# EAGLE design RPi_RFM12B_ISP (EAGLE 6.2)
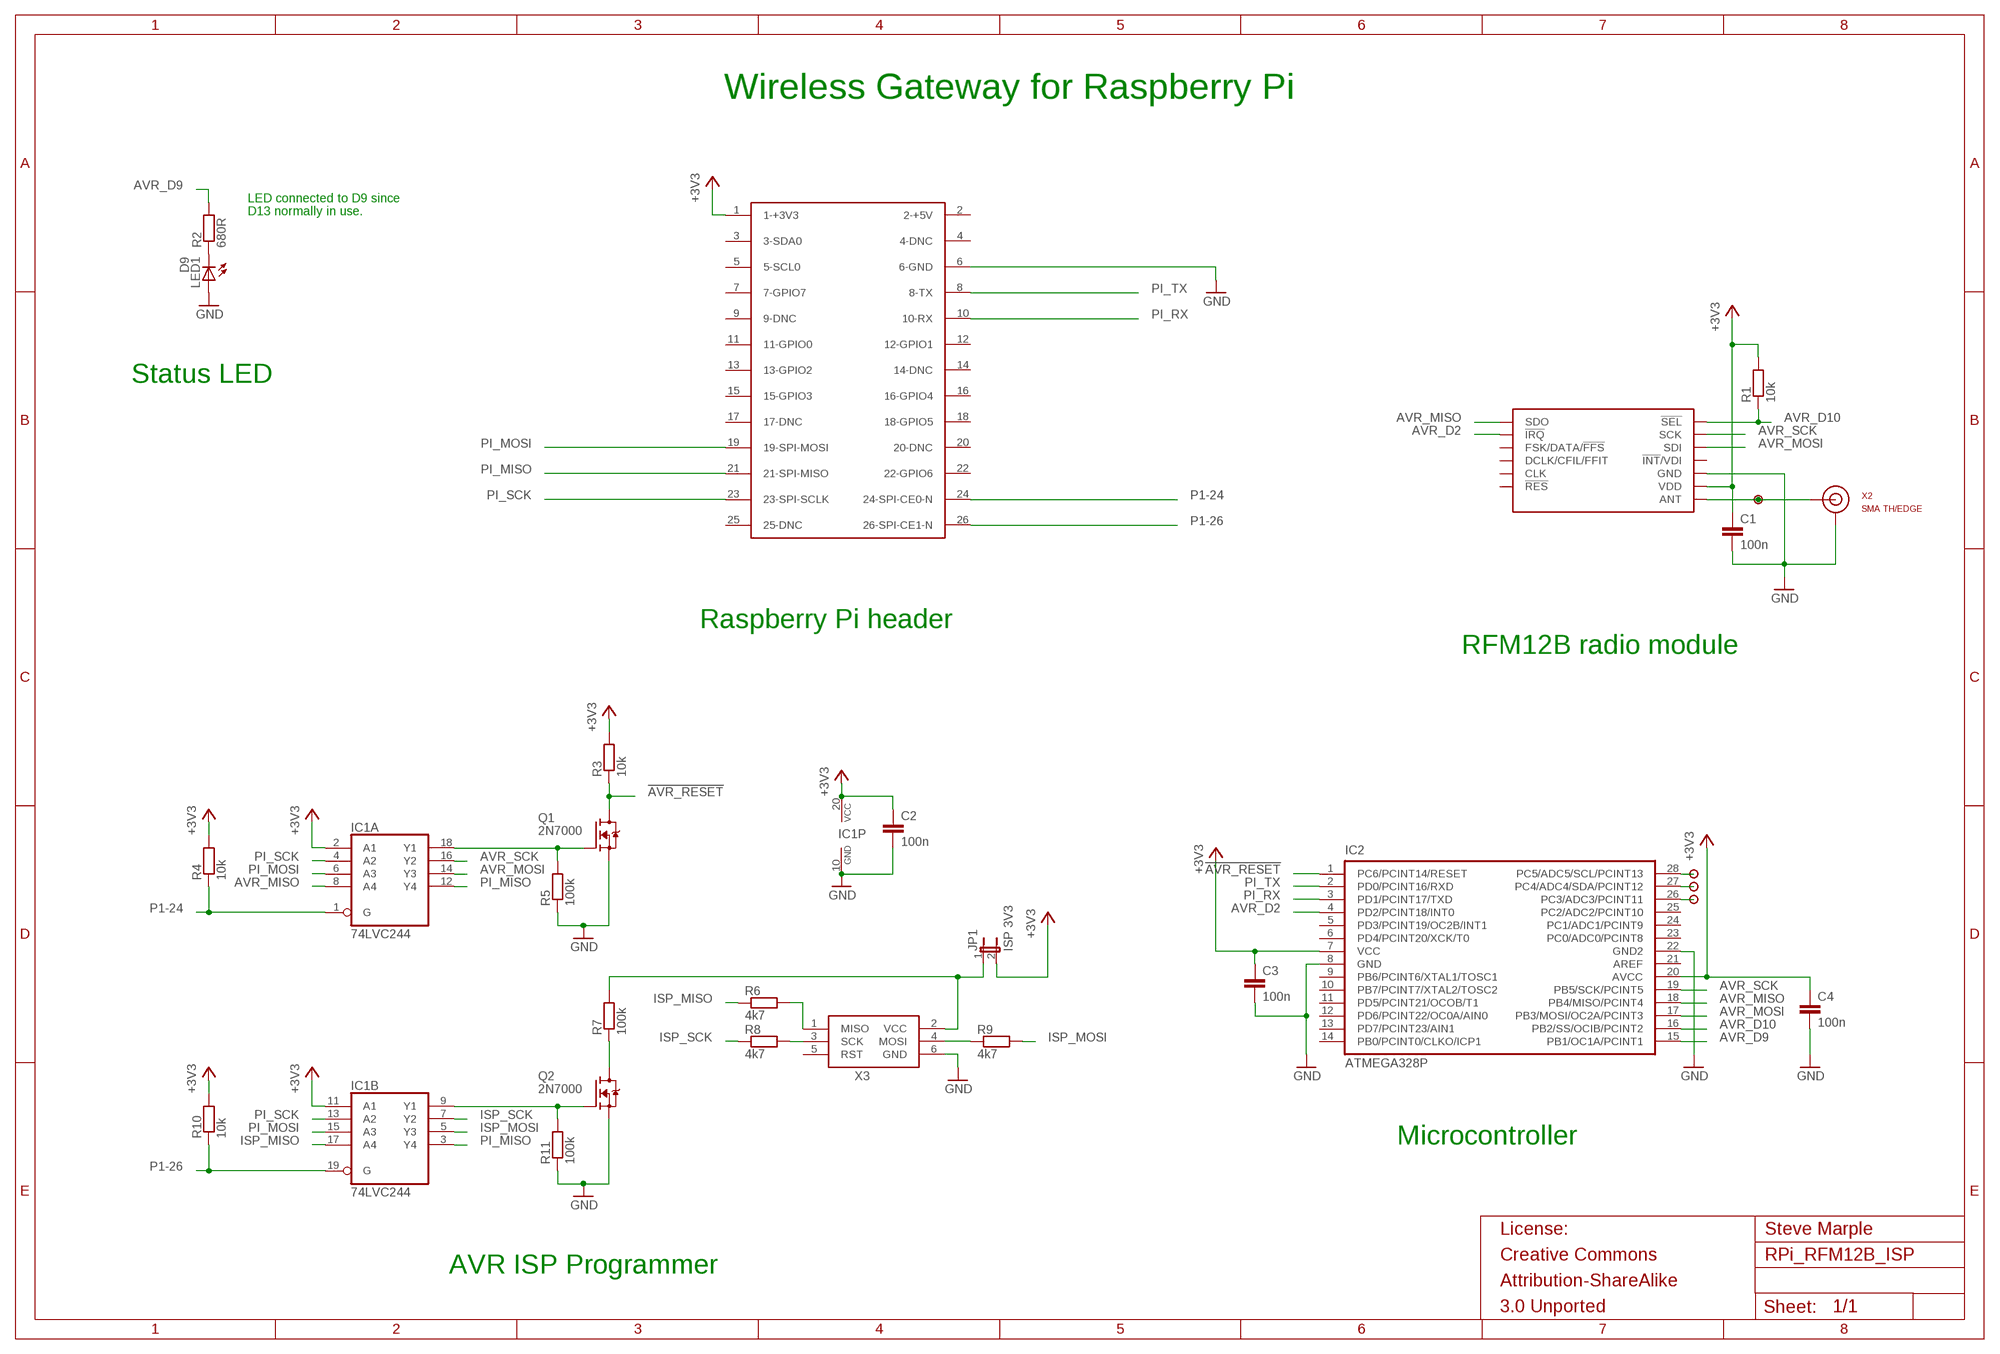
[diagram p0: schematic, sheet 1]

## Parts
AVR_A1  PAD  [PAD]
AVR_A2  PAD  [PAD]
AVR_A3  PAD  [PAD]
C1  100n  CAPPTH  [CAP-PTH-SMALL]
C2  100n  CAPPTH  [CAP-PTH-SMALL]
C3  100n  CAPPTH  [CAP-PTH-SMALL]
C4  100n  CAPPTH  [CAP-PTH-SMALL]
IC1  74LVC244  74HC244N  [DIL20]
IC2  ATMEGA328P  IC_UC_ATMEGA328PDIL  [DIL28-N]
JP1  ISP 3V3  JUMPER-2PTH  [1X02]
LED1  D9  LED3MM  [LED3MM]
Q1  2N7000  [TO-92]
Q2  2N7000  [TO-92]
R1  10k  RESISTOR  [RES-AXIAL-0.4]
R2  680R  RESISTOR  [RES-AXIAL-0.4]
R3  10k  RESISTOR  [RES-AXIAL-0.4]
R4  10k  RESISTOR  [RES-AXIAL-0.4]
R5  100k  RESISTOR  [RES-AXIAL-0.4]
R6  4k7  RESISTOR  [RES-AXIAL-0.4]
R7  100k  RESISTOR  [RES-AXIAL-0.4]
R8  4k7  RESISTOR  [RES-AXIAL-0.4]
R9  4k7  RESISTOR  [RES-AXIAL-0.4]
R10  10k  RESISTOR  [RES-AXIAL-0.4]
R11  100k  RESISTOR  [RES-AXIAL-0.4]
RF1  RFM12B  RFM12BSMD  [RFM12B]
RFM12B_ANT  PAD  [PAD]
X1  P1A  RASPBERRY-PIHEADER  [RASPBERRY-PI-HEADER]
X2  SMA TH/EDGE  CONN-SMATHD-SMD-EDGE  [SMA-THD-EDGE]
X3  AVR ISP  AVRISP-HEADER-6-SHROUDED  [CONN-HARTING-ML6]

## Nets
!AVR_RESET: IC2.1(PC6/PCINT14/RESET) Q1.3(D) R3.P$1
+3V3 [power]: C1.1 C2.1 C3.1 C4.1 IC1.2(A:A1) IC1.11(B:A1) IC1.20(P:VCC) IC2.7(VCC) IC2.20(AVCC) JP1.2 R1.P$2 R3.P$2 R4.P$2 R10.P$2 RF1.VDD X1.1(1-+3V3)
AVR_D2: IC2.4(PD2/PCINT18/INT0) RF1.!IRQ
AVR_D9: IC2.15(PB1/OC1A/PCINT1) R2.P$2
AVR_D10: IC2.16(PB2/SS/OCIB/PCINT2) R1.P$1 RF1.!SEL
AVR_MISO: IC1.8(A:A4) IC2.18(PB4/MISO/PCINT4) RF1.SDO
AVR_MOSI: IC1.14(A:Y3) IC2.17(PB3/MOSI/OC2A/PCINT3) RF1.SDI
AVR_SCK: IC1.16(A:Y2) IC2.19(PB5/SCK/PCINT5) RF1.SCK
GND [power]: C1.2 C2.2 C3.2 C4.2 IC1.10(P:GND) IC2.8(GND) IC2.22(GND2) LED1.A Q1.1(S) Q2.1(S) R5.P$1 R11.P$1 RF1.GND@0(GND) RF1.GND@1(GND) X1.6(6-GND) X2.GND@0(GND) X2.GND@1(GND) X2.GND@2(GND) X2.GND@3(GND) X2.GND@EDGE0(GND) X2.GND@EDGE1(GND) X2.GND@EDGE2(GND) X2.GND@EDGE3(GND) X3.6(GND)
ISP_MISO [power]: IC1.17(B:A4) R6.P$1
ISP_MOSI: IC1.5(B:Y3) R9.P$2
ISP_SCK: IC1.7(B:Y2) R8.P$1
N$1 [antenna]: RF1.ANT RFM12B_ANT.1 X2.SIG(SIGNAL) X2.SIG@EDGE(SIGNAL)
N$2: LED1.K(C) R2.P$1
N$3: AVR_A1.1 IC2.28(PC5/ADC5/SCL/PCINT13)
N$4: AVR_A2.1 IC2.27(PC4/ADC4/SDA/PCINT12)
N$5: AVR_A3.1 IC2.26(PC3/ADC3/PCINT11)
N$32: IC1.18(A:Y1) Q1.2(G) R5.P$2
N$44: R8.P$2 X3.3(SCK)
N$45: R6.P$2 X3.1(MISO)
N$47: IC1.9(B:Y1) Q2.2(G) R11.P$2
N$48: Q2.3(D) R7.P$1
N$49: JP1.1 R7.P$2 X3.2(VCC)
N$50: R9.P$1 X3.4(MOSI)
P1-24: IC1.1(A:G) R4.P$1 X1.24(24-SPI-CE0-N)
P1-26: IC1.19(B:G) R10.P$1 X1.26(26-SPI-CE1-N)
PI_MISO: IC1.3(B:Y4) IC1.12(A:Y4) X1.21(21-SPI-MISO)
PI_MOSI: IC1.6(A:A3) IC1.15(B:A3) X1.19(19-SPI-MOSI)
PI_RX: IC2.3(PD1/PCINT17/TXD) X1.10(10-RX)
PI_SCK: IC1.4(A:A2) IC1.13(B:A2) X1.23(23-SPI-SCLK)
PI_TX: IC2.2(PD0/PCINT16/RXD) X1.8(8-TX)
Unconnected: IC2.5(PD3/PCINT19/OC2B/INT1) IC2.6(PD4/PCINT20/XCK/T0) IC2.9(PB6/PCINT6/XTAL1/TOSC1) IC2.10(PB7/PCINT7/XTAL2/TOSC2) IC2.11(PD5/PCINT21/OCOB/T1) IC2.12(PD6/PCINT22/OC0A/AIN0) IC2.13(PD7/PCINT23/AIN1) IC2.14(PB0/PCINT0/CLKO/ICP1) IC2.21(AREF) IC2.23(PC0/ADC0/PCINT8) IC2.24(PC1/ADC1/PCINT9) IC2.25(PC2/ADC2/PCINT10) RF1.!INT!/VDI RF1.!RES RF1.CLK RF1.DCLK/CFIL/FFIT RF1.FSK/DATA/!FFS X1.2(2-+5V) X1.3(3-SDA0) X1.4(4-DNC) X1.5(5-SCL0) X1.7(7-GPIO7) X1.9(9-DNC) X1.11(11-GPIO0) X1.12(12-GPIO1) X1.13(13-GPIO2) X1.14(14-DNC) X1.15(15-GPIO3) X1.16(16-GPIO4) X1.17(17-DNC) X1.18(18-GPIO5) X1.20(20-DNC) X1.22(22-GPIO6) X1.25(25-DNC) X3.5(RST)

## Notes on the sheet
- Wireless Gateway for Raspberry Pi
- LED connected to D9 since
- D13 normally in use.
- Status LED
- Raspberry Pi header
- RFM12B radio module
- Microcontroller
- License: | Steve Marple
- Creative Commons
- AVR ISP Programmer
- Attribution-ShareAlike
- 3.0 Unported

## Library data of the parts
AVR_A1-AVR_A3 RFM12B_ANT = SteveMarple:PAD
C1-C4 = SparkFun:CAP: Capacitor Standard 0603 ceramic capacitor, and 0.1" leaded capacitor.
IC1 = 74xx-eu:74*244: Octal BUFFER and LINE DRIVER, 3-state
IC2 = dp_devices:IC_UC_ATMEGA328P
JP1 = SparkFun:JUMPER-2: Jumper Basic 0.1" spaced jumper. Use with breakaway headers.
LED1 = SparkFun:LED: LEDs Standard schematic elements and footprints for 5mm, 3mm, 1206, and 0603 sized LEDs. 5mm - Spark Fun Electronics SKU : COM-00529 (and others)
Q1 Q2 = SteveMarple:2N7000: 2N7000 FET
R1-R11 = SteveMarple:RESISTOR: 1/4W PTH resistor
RF1 = SteveMarple:RFM12B: RFM12B radio module by HopeRF
X1 = SteveMarple:RASPBERRY-PI: Raspberry Pi Board <http://www.raspberrypi.org/> Jacques Lagnel V1.0 (beta) 2012 Board dimension: Forum 3D model <http://www.raspberrypi.org/forum/general-discussion/mechanical-profile-3d-models?value=3d%20model&type=1&include=1&search=1&ret=all> The GPIO Connector (P1): http://elinux.org/RPi_Low-level_peripherals
X2 = SteveMarple:CONN-SMA: SMA connector
X3 = SteveMarple:AVRISP: AVR ISP HEADER Standard 6 pin header for AVR programming

## Net classes
1 power: width 0.381 mm
2 5V: width 0.381 mm
3 antenna: width 0.61 mm

## Board
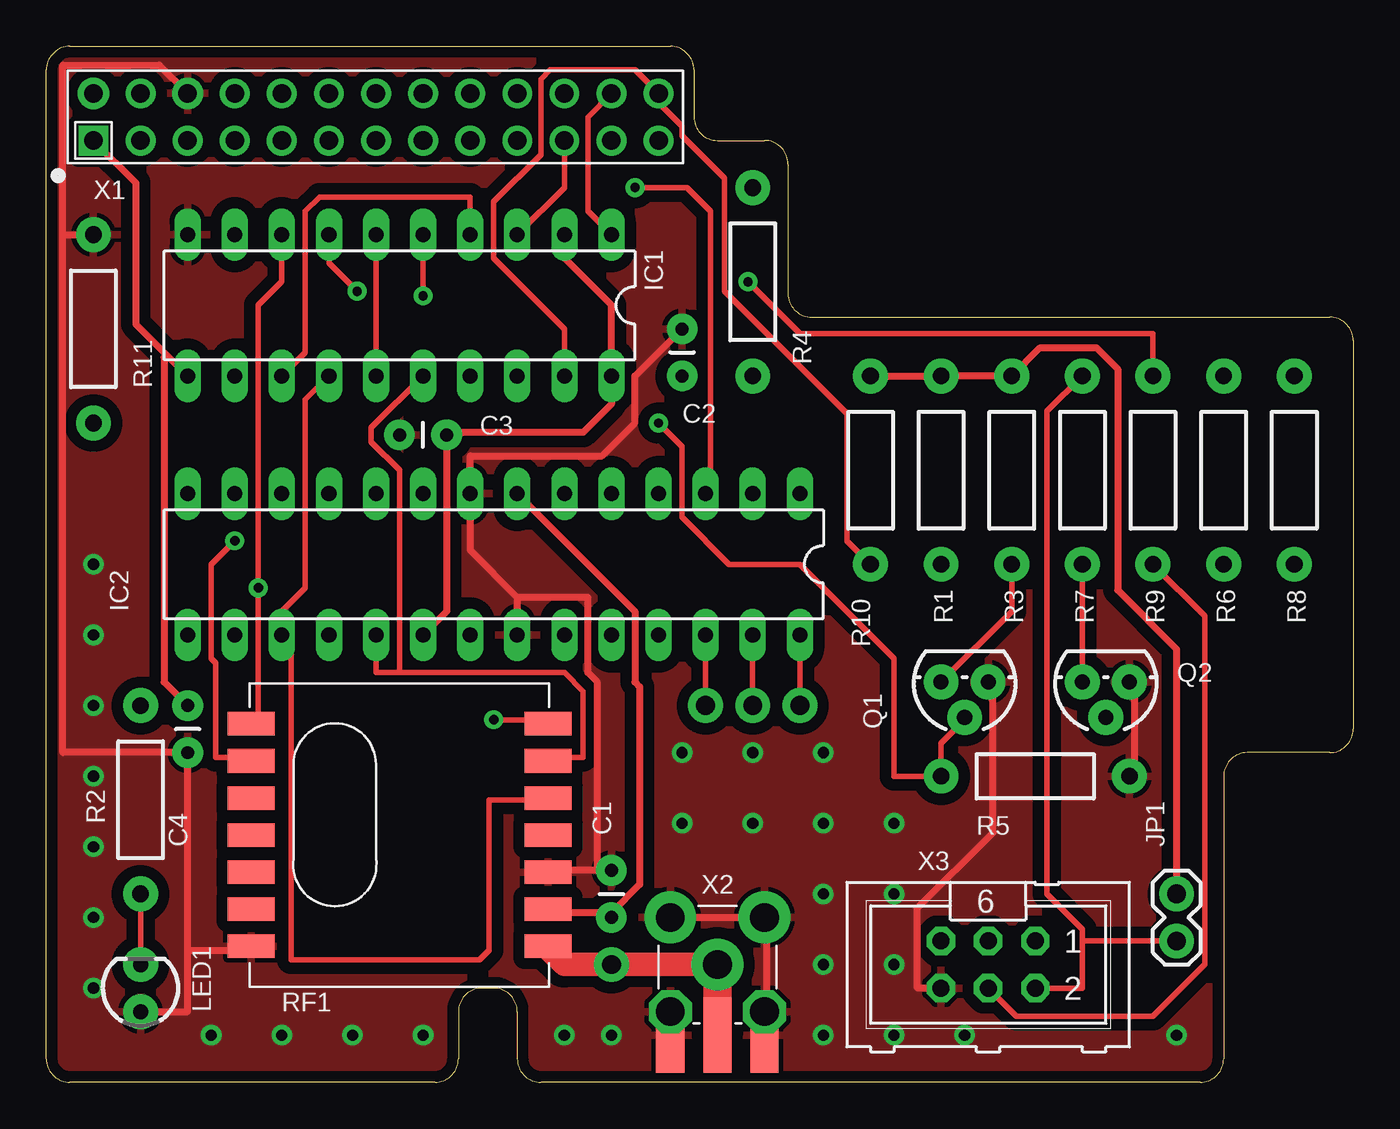
[diagram p1: board, top side]
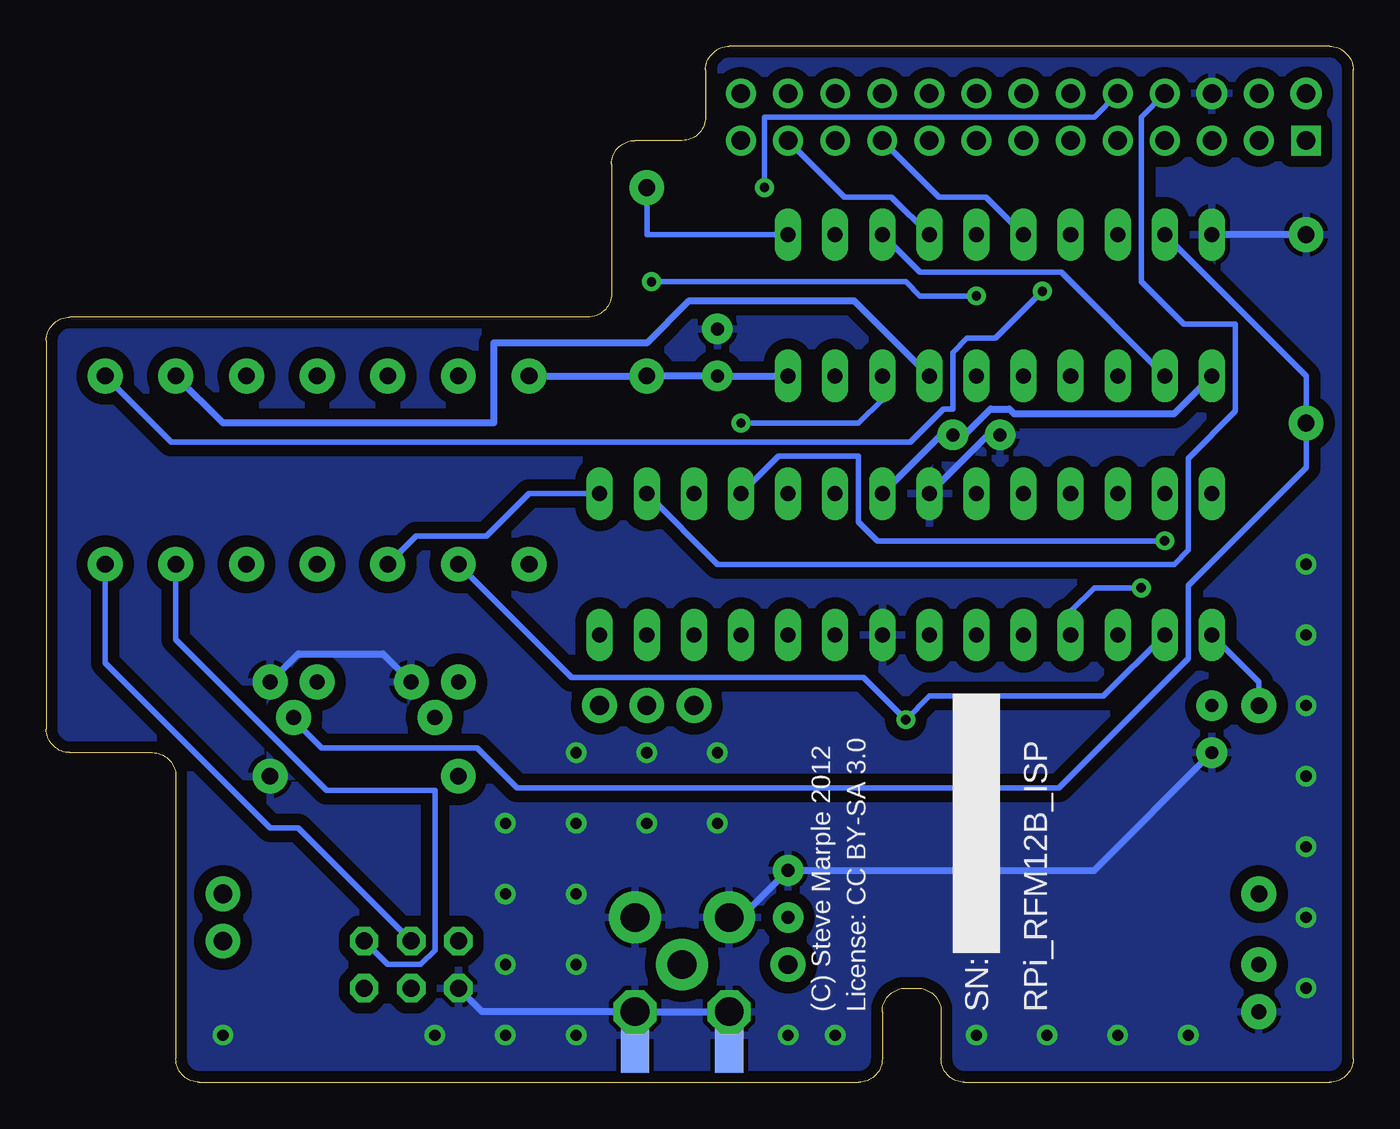
[diagram p2: board, bottom side, seen from below]

Size 70.48 x 55.88 mm. Coordinates in mm from the lower left corner, seen from the top.
Outline: 0,1.27 0,54.61 arc-90 1.27,55.88 33.66,55.88 arc-90 34.92,54.61 34.92,52.07 arc90 36.2,50.8 38.73,50.8 arc-90 40.01,49.53 40.01,42.55 arc90 41.27,41.27 69.22,41.27 arc-90 70.48,40.01 70.48,19.05 arc-90 69.22,17.78 64.77,17.78 arc90 63.5,16.51 63.5,1.27 arc-90 62.23,0 26.67,0 arc-90 25.4,1.27 25.4,3.81 arc90 24.13,5.08 23.5,5.08 arc90 22.23,3.81 22.23,1.27 arc-90 20.95,0 1.27,0 arc-90 0,1.27
Copper layers (1*16): Top 0.035mm / dielectric 1.5mm / Bottom 0.035mm
Design rules: minimum track width 10mil, minimum drill 20mil, track to track 10mil, track to pad 10mil, pad to pad 10mil, via to via 10mil, smd to smd 10mil, copper to edge 0.5mm, drill to drill 8mil, minimum pad ring 12mil, minimum via ring 10mil, stop-mask expansion 4mil, vias tented up to drill 25mil, thermal gap 10mil
tRestrict: area 14.6,7 to 23.5,19.7

### Footprints (pad centres in the part's own frame; a part is rotated, then mirrored left to right if it is on the bottom)
PAD = drill 1.016 pad 1.88: 1 0,0
CAP-PTH-SMALL = drill 0.7 pad 1.651: 1 0,0; 2 2.54,0
DIL20 = drill 0.813 long: 1 -11.43,-3.81; 2 -8.89,-3.81; 3 -6.35,-3.81; 4 -3.81,-3.81; 5 -1.27,-3.81; 6 1.27,-3.81; 7 3.81,-3.81; 8 6.35,-3.81; 9 8.89,-3.81; 10 11.43,-3.81; 11 11.43,3.81; 12 8.89,3.81; 13 6.35,3.81; 14 3.81,3.81; 15 1.27,3.81; 16 -1.27,3.81; 17 -3.81,3.81; 18 -6.35,3.81; 19 -8.89,3.81; 20 -11.43,3.81
DIL28-N = drill 0.813 long: 1 -16.51,-3.81; 2 -13.97,-3.81; 3 -11.43,-3.81; 4 -8.89,-3.81; 5 -6.35,-3.81; 6 -3.81,-3.81; 7 -1.27,-3.81; 8 1.27,-3.81; 9 3.81,-3.81; 10 6.35,-3.81; 11 8.89,-3.81; 12 11.43,-3.81; 13 13.97,-3.81; 14 16.51,-3.81; 15 16.51,3.81; 16 13.97,3.81; 17 11.43,3.81; 18 8.89,3.81; 19 6.35,3.81; 20 3.81,3.81; 21 1.27,3.81; 22 -1.27,3.81; 23 -3.81,3.81; 24 -6.35,3.81; 25 -8.89,3.81; 26 -11.43,3.81; 27 -13.97,3.81; 28 -16.51,3.81
1X02 = drill 1.016 pad 1.88: 1 0,0; 2 2.54,0
LED3MM = drill 0.813 pad 1.88: A -1.27,0; K 1.27,0
TO-92 = drill 0.813 pad 1.88: 1 -1.27,0; 2 0,1.905; 3 1.27,0
RES-AXIAL-0.4 = drill 0.9 pad 1.88: P$1 -5.08,0; P$2 5.08,0
RFM12B = smd 2.54 x 1.27: !INT!/VDI 8,0; !IRQ -8,4; !RES -8,-4; !SEL 8,6; ANT 8,-6; CLK -8,-2; DCLK/CFIL/FFIT -8,0; FSK/DATA/!FFS -8,2; GND@0 -8,-6; GND@1 8,-2; SCK 8,4; SDI 8,2; SDO -8,6; VDD 8,-4
RASPBERRY-PI-HEADER = drill 1 square: 1 0,0 | drill 1 pad 1.676: 2 0,2.54; 6 5.08,2.54 | drill 1: 3 2.54,0; 4 2.54,2.54; 5 5.08,0; 7 7.62,0; 8 7.62,2.54; 9 10.16,0; 10 10.16,2.54; 11 12.7,0; 12 12.7,2.54; 13 15.24,0; 14 15.24,2.54; 15 17.78,0; 16 17.78,2.54; 17 20.32,0; 18 20.32,2.54; 19 22.86,0; 20 22.86,2.54; 21 25.4,0; 22 25.4,2.54; 23 27.94,0; 24 27.94,2.54; 25 30.48,0; 26 30.48,2.54
SMA-THD-EDGE = drill 1.549 pad 2.794: GND@0 -2.54,2.54; GND@1 2.54,2.54; SIG 0,0 | drill 1.549 pad 2.184 octagon: GND@2 2.54,-2.54; GND@3 -2.54,-2.54 | smd 1.524 x 4.064: GND@EDGE0 -2.54,-3.81; GND@EDGE1 2.54,-3.81; SIG@EDGE 0,-3.81 | smd 1.524 x 4.064 bottom: GND@EDGE2 -2.54,-3.81; GND@EDGE3 2.54,-3.81
CONN-HARTING-ML6 = drill 0.914 octagon: 1 -2.54,-1.27; 2 -2.54,1.27; 3 0,-1.27; 4 0,1.27; 5 2.54,-1.27; 6 2.54,1.27

### Placement (x,y rotation side)
AVR_A1  40.64,20.32 90 top
AVR_A2  38.1,20.32 90 top
AVR_A3  35.56,20.32 90 top
C1  30.48,8.89 90 top
C2  34.29,38.1 90 top
C3  21.59,34.92 180 top
C4  7.62,20.32 270 top
IC1  19.05,41.91 180 top
IC2  24.13,27.94 180 top
JP1  60.96,7.62 90 top
LED1  5.08,5.08 90 top
Q1  49.53,21.59 180 top
Q2  57.15,21.59 180 top
R1  48.26,33.02 90 top
R2  5.08,15.24 90 top
R3  52.07,33.02 90 top
R4  38.1,43.18 270 top
R5  53.34,16.51 180 top
R6  63.5,33.02 270 top
R7  55.88,33.02 90 top
R8  67.31,33.02 270 top
R9  59.69,33.02 90 top
R10  44.45,33.02 90 top
R11  2.54,40.64 270 top
RF1  19.05,13.34 0 top
RFM12B_ANT  30.48,6.35 0 top
X1  2.54,50.8 0 top
X2  36.2,6.35 0 top
X3  50.8,6.35 180 top

### Tracks (layer width: path | path; a pad name or v marks a point on that pad's centre or on a via)
!AVR_RESET
  Top 0.305: Q1.3 52.07,25.4 R3.P$1
  Bottom 0.305: IC2.1 44.45,31.75 46.74,29.46 50.55,29.46 R3.P$1
+3V3
  Top 0.381: 6.48,39.24 4.83,40.89 4.83,48.51 X1.1 | 6.48,39.24 IC1.11 | C4.1 6.35,21.59 6.35,39.12 6.48,39.24 | 30.48,9.14 27.18,9.14 RF1.VDD | IC2.20 21.59,25.4 C3.1 21.59,35.05 28.96,35.05 30.48,36.58 IC1.20 30.48,41.91 27.94,44.45 IC1.2 | 30.48,9.14 32,10.67 32,21.34 31.75,21.59 31.75,25.4 IC2.7 | 30.48,9.14 C1.1 | JP1.2 60.96,23.37 57.78,26.54 57.78,38.48 56.64,39.62 53.59,39.62 R3.P$2 R1.P$2 R10.P$2
  Bottom 0.381: IC2.7 22.35,34.8 21.59,34.8 C3.1 21.59,35.05 20.83,35.05 19.56,36.32 18.54,36.32 18.29,36.07 9.65,36.07 IC1.11 | IC1.20 C2.1 R4.P$2 R10.P$2
AVR_D2  (via drill 0.51)
  Top 0.305: v10.16,29.21 8.89,27.94 8.89,22.86 9.14,22.61 9.14,17.53 10.92,17.53 RF1.!IRQ
  Bottom 0.305: v10.16,29.21 25.65,29.21 26.67,30.23 26.67,33.78 30.99,33.78 IC2.4
AVR_D9
  Bottom 0.305: IC2.15 5.08,21.59 R2.P$2
AVR_D10  (via drill 0.51)
  Top 0.305: v24.13,19.56 26.92,19.56 RF1.!SEL
  Bottom 0.305: IC2.16 13.46,20.83 22.86,20.83 v24.13,19.56 26.42,21.84 42.16,21.84 R1.P$1
AVR_MISO  (via drill 0.51)
  Top 0.305: IC1.8 12.7,43.18 11.43,41.91 v11.43,26.67 11.43,19.81 11.18,19.56 RF1.SDO
  Bottom 0.305: IC2.18 15.24,25.4 13.97,26.67 v11.43,26.67
AVR_MOSI
  Top 0.305: RF1.SDI 26.92,15.24 23.88,15.24 23.88,7.11 23.37,6.6 13.21,6.6 13.21,23.62 IC2.17 12.7,25.4 13.97,26.67 13.97,36.83 IC1.14
AVR_SCK
  Top 0.305: 19.05,22.1 17.78,22.1 IC2.19 | 19.05,22.1 27.94,22.1 28.96,21.08 28.96,17.53 27.18,17.53 RF1.SCK | IC1.16 17.53,35.31 17.53,34.54 19.05,33.02 19.05,22.1
GND  (via drill 0.6)
  Top 0.381: X1.6 6.1,54.86 0.89,54.86 0.89,45.72 | 11.18,7.37 RF1.GND@0 10.92,7.11 7.62,7.11 | 7.62,7.11 7.62,3.81 LED1.A | 7.62,7.11 C4.2 0.89,17.78 0.89,45.72 | 0.89,45.72 R11.P$1 | 25.4,26.16 22.86,28.7 IC2.8 22.86,33.78 29.97,33.78 31.75,35.56 31.75,38.1 C2.2 | 25.4,26.16 IC2.22 | 29.72,11.43 27.18,11.43 RF1.GND@1 | X2.GND@0 X2.GND@1 38.86,8.89 38.86,3.81 | R5.P$1 58.67,16.76 58.67,21.34 Q2.1 | X2.GND@EDGE2 33.78,2.54 33.78,3.81 X2.GND@3 | 38.86,3.81 38.86,2.54 X2.GND@EDGE3 | Q1.1 51.05,21.34 51.05,13.46 46.99,9.4 46.99,5.08 X3.6 | 38.86,3.81 X2.GND@2 | 25.4,26.16 29.21,26.16 29.21,22.1 29.72,21.59 29.72,11.43 | 29.72,11.43 C1.2
  Bottom 0.381: R11.P$1 IC1.10 | IC2.8 19.81,34.8 19.05,34.8 C3.2 | X2.GND@0 33.02,8.89 C1.2 13.97,11.43 C4.2 | Q1.1 52.32,23.11 56.9,23.11 Q2.1 | 33.78,3.81 33.78,2.54 X2.GND@EDGE2 | 33.78,3.81 X2.GND@2 38.86,3.81 | 33.78,3.81 X2.GND@3 | X3.6 46.99,3.81 38.86,3.81 | 38.86,3.81 X2.GND@EDGE3
  other vias: 2.54,5.08 2.54,8.89 2.54,12.7 16.51,2.54 20.32,2.54 27.94,2.54 30.48,2.54 41.91,2.54 41.91,6.35 41.91,10.16 41.91,13.97 38.1,13.97 34.29,13.97 45.72,2.54 45.72,6.35 45.72,10.16 45.72,13.97 12.7,2.54 8.89,2.54 2.54,16.51 34.29,17.78 38.1,17.78 41.91,17.78 49.53,2.54 60.96,2.54 2.54,20.32 2.54,24.13 2.54,27.94
  pour Bottom (isolate 0.61): -1.27,-1.27 -1.27,57.15 72.39,57.15 72.39,-1.27
  pour Top (isolate 0.61): -2.54,-2.54 -2.54,58.42 73.66,58.42 73.66,-2.54
ISP_MISO
  Bottom 0.381: IC1.17 26.92,42.16 35.81,42.16 38.1,39.88 46.35,39.88 46.35,35.56 60.96,35.56 R6.P$1
ISP_MOSI  (via drill 0.51)
  Top 0.305: v20.32,42.42 IC1.5 | v37.85,43.18 40.64,40.39 59.69,40.39 R9.P$2
  Bottom 0.305: v20.32,42.42 23.37,42.42 24.13,43.18 v37.85,43.18
ISP_SCK  (via drill 0.51)
  Top 0.305: IC1.7 15.24,44.2 v16.76,42.67
  Bottom 0.305: v16.76,42.67 19.3,40.13 20.83,40.13 21.59,39.37 21.59,36.32 22.1,36.32 23.88,34.54 63.75,34.54 R8.P$1
N$1
  Top 0.61: 27.18,7.11 RF1.ANT
  Top 1.27: 27.18,7.11 27.94,6.35 RFM12B_ANT.1 X2.SIG
N$2
  Top 0.305: R2.P$1 LED1.K
N$3
  Top 0.305: AVR_A1.1 IC2.28
N$4
  Top 0.305: AVR_A2.1 IC2.27
N$5
  Top 0.305: AVR_A3.1 IC2.26
N$32  (via drill 0.51)
  Top 0.305: v33.02,35.56 34.29,34.29 34.29,30.48 36.83,27.94 40.64,27.94 45.72,22.86 45.72,16.51 R5.P$2 48.26,18.29 49.53,19.56 Q1.2
  Bottom 0.305: IC1.18 25.4,36.83 26.67,35.56 v33.02,35.56
N$44
  Bottom 0.305: X3.3 56.9,13.72 58.42,13.72 67.31,22.61 R8.P$2
N$45
  Bottom 0.305: X3.1 52.07,6.35 50.29,6.35 49.53,7.11 49.53,15.75 55.37,15.75 63.5,23.88 R6.P$2
N$47
  Bottom 0.305: IC1.9 2.54,38.1 R11.P$2 2.54,33.15 8.89,26.8 8.89,22.86 15.88,15.88 45.09,15.88 47.24,18.03 55.63,18.03 57.15,19.56 Q2.2
N$48
  Top 0.305: R7.P$1 Q2.3
N$49
  Top 0.305: JP1.1 55.88,7.62 | X3.2 55.88,5.08 55.88,7.62 | R7.P$2 53.98,36.2 53.98,10.16 55.88,8.26 55.88,7.62
N$50
  Top 0.305: X3.4 52.32,3.56 59.69,3.56 62.48,6.35 62.48,25.15 R9.P$1
P1-24
  Top 0.305: X1.24 29.21,52.07 29.21,46.99 IC1.1
  Bottom 0.305: R4.P$1 38.1,45.72 IC1.1
P1-26
  Top 0.305: IC1.19 27.94,40.64 24.13,44.45 24.13,47.5 26.67,50.04 26.67,54.1 27.18,54.61 31.75,54.61 X1.26 33.02,52.83 34.29,51.56 34.29,51.05 36.58,48.77 36.58,42.67 43.18,36.07 43.18,29.21 R10.P$1
PI_MISO
  Top 0.305: X1.21 27.94,48.26 IC1.3
  Bottom 0.305: IC1.12 15.75,43.69 23.37,43.69 IC1.3
PI_MOSI
  Top 0.305: IC1.6 IC1.15
  Bottom 0.305: X1.19 22.35,47.75 19.81,47.75 IC1.6
PI_RX  (via drill 0.51)
  Top 0.305: IC2.3 35.81,32 35.81,46.99 34.54,48.26 v31.75,48.26
  Bottom 0.305: v31.75,48.26 31.75,52.07 13.97,52.07 X1.10
PI_SCK
  Top 0.305: IC1.13 13.97,39.37 13.97,46.99 14.73,47.75 22.86,47.75 IC1.4
  Bottom 0.305: X1.23 27.43,47.75 24.89,47.75 IC1.4
PI_TX
  Bottom 0.305: IC2.2 34.29,27.94 9.65,27.94 8.89,28.7 8.89,33.66 6.35,36.2 6.35,40.89 9.14,40.89 11.43,43.18 11.43,52.07 X1.8

### Text on the board
bNames: SN:
_bsilk: License: CC BY-SA 3.0 | (C) Steve Marple 2012